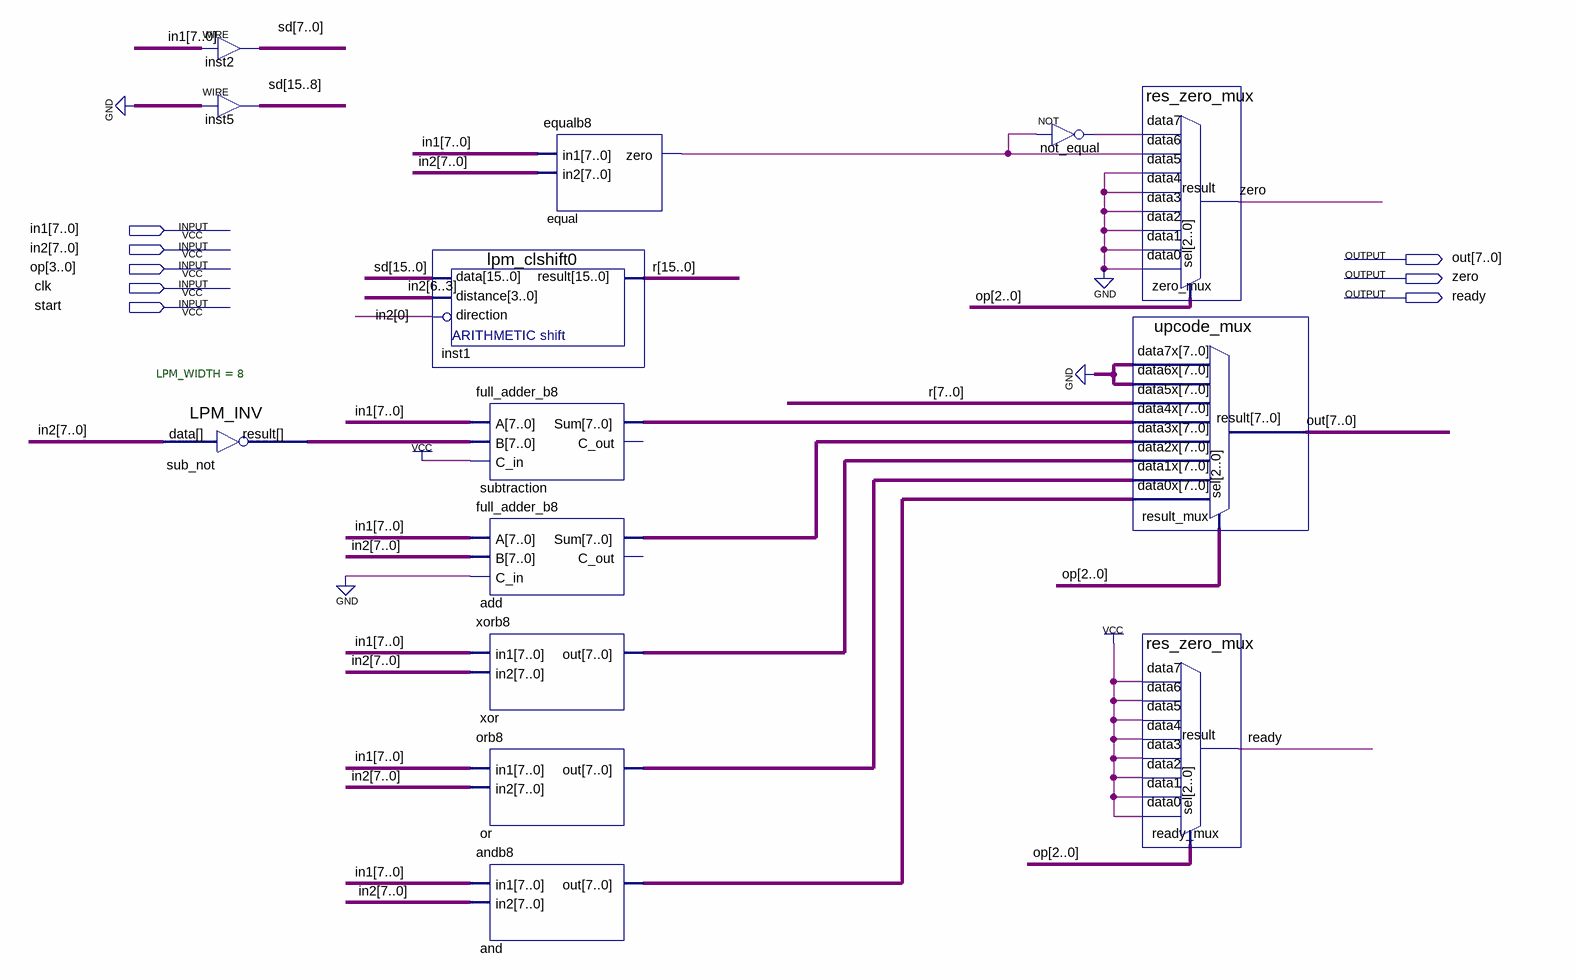
[diagram p0: schematic sheet]
// Quartus schematic alu.bdf as structural Verilog: 14 symbols, 8 pins
module alu (
  input  [7:0] in1,
  input  [7:0] in2,
  input  [3:0] op,
  input  clk,
  input  start,
  output [7:0] out,
  output zero,
  output ready
);

  wire equal_zero, not_equal_out;
  wire [7:0] add_sum, and_out, or_out, sub_not_result, subtraction_sum, xor_out;
  wire [15:0] r, sd;

  assign sd[7:0] = in1;  // WIRE inst2
  assign sd[15:8] = {8{1'b0}};  // WIRE inst5
  LPM_INV #(.LPM_WIDTH(8)) sub_not (.data(in2), .result(sub_not_result));
  lpm_clshift0 inst1 (.data(sd), .distance(in2[6:3]), .direction(~in2[0]), .result(r));
  full_adder_b8 subtraction (.A(in1), .B(sub_not_result), .C_in(1'b1), .Sum(subtraction_sum));  // open: C_out
  full_adder_b8 add (.A(in1), .B(in2), .C_in(1'b0), .Sum(add_sum));  // open: C_out
  xorb8 \xor  (.in1(in1), .in2(in2), .out(xor_out));
  orb8 \or  (.in1(in1), .in2(in2), .out(or_out));
  andb8 \and  (.in1(in1), .in2(in2), .out(and_out));
  equalb8 equal (.in1(in1), .in2(in2), .zero(equal_zero));
  not not_equal (not_equal_out, equal_zero);
  res_zero_mux zero_mux (
    .data7(not_equal_out), .data6(equal_zero), .data5(1'b0), .data4(1'b0), .data3(1'b0), .data2(1'b0),
    .data1(1'b0), .data0(1'b0), .sel(op[2:0]), .result(zero));
  upcode_mux result_mux (
    .data7x({8{1'b0}}), .data6x({8{1'b0}}), .data5x(r[7:0]), .data4x(subtraction_sum), .data3x(add_sum),
    .data2x(xor_out), .data1x(or_out), .data0x(and_out), .sel(op[2:0]), .result(out));
  res_zero_mux ready_mux (
    .data7(1'b1), .data6(1'b1), .data5(1'b1), .data4(1'b1), .data3(1'b1), .data2(1'b1), .data1(1'b1),
    .data0(1'b1), .sel(op[2:0]), .result(ready));
endmodule
